# Altium schematic sheet AC2.SchDoc: AMF CONTROLLER GC12
size A4; Author: SURAJ; CompanyName: SIMCONS; DrawnBy: SURAJ; Engineer: SURAJ; Organization: SIMCONS; Drawing TiTLE: SIMCONS AMF
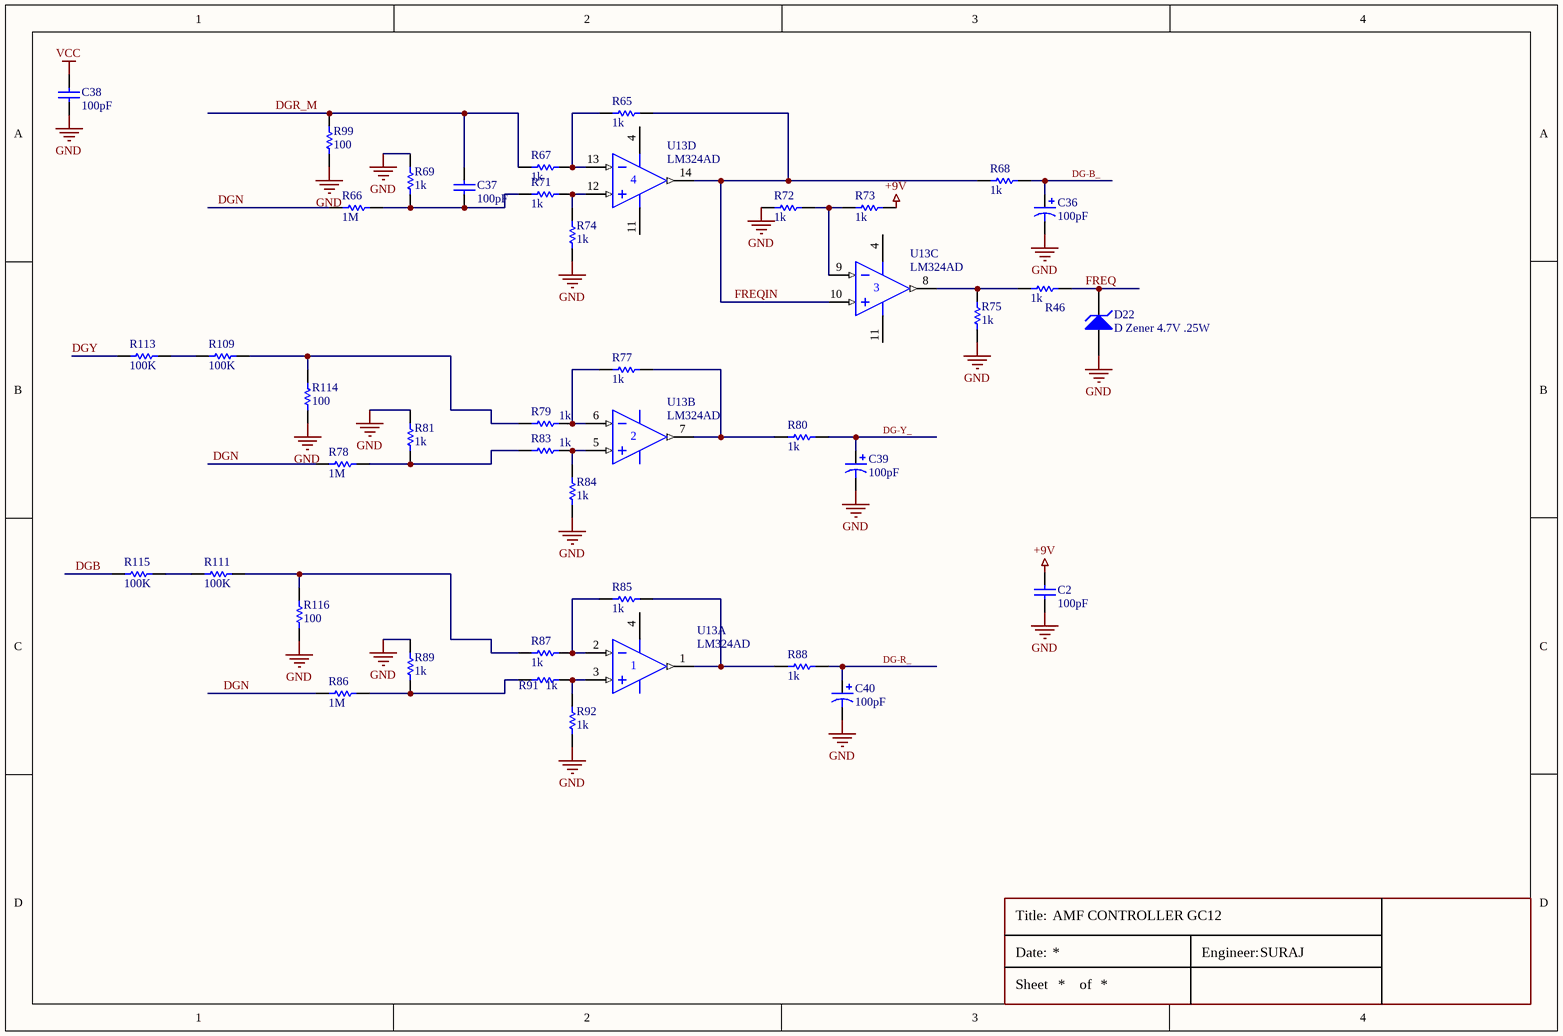
[diagram p0: AC2.SchDoc]

## Parts
C2  value 100pF  [C1206VW]  (hidden comment: .1uF 1206)
C36  value 100pF  [Cap_.1]  (hidden comment: 10uF/63V)
C37  value 100pF  [C1206VW]  (hidden comment: 22nF 1206)
C38  value 100pF  [C1206VW]  (hidden comment: .1uF 1206)
C39  value 100pF  [Cap_.1]  (hidden comment: 10uF/63V)
C40  value 100pF  [Cap_.1]  (hidden comment: 10uF/63V)
D22  D Zener 4.7V .25W  [DZENOR .25W]
R46  value 1k  [R1206VW]  (hidden comment: 470E 1206)
R65  value 1k  [R1206VW]  (hidden comment: 1M 1206)
R66  value 1M  [RES_RAD_1W]  (hidden comment: 1M MFR)
R67  value 1k  [R1206VW]  (hidden comment: 220K 1206)
R68  value 1k  [R1206VW]  (hidden comment: 33K 1206)
R69  value 1k  [R1206VW]  (hidden comment: 4.7K 1206)
R71  value 1k  [R1206VW]  (hidden comment: 220K 1206)
R72  value 1k  [R1206VW]  (hidden comment: 1K 1206)
R73  value 1k  [R1206VW]  (hidden comment: 10K 1206)
R74  value 1k  [R1206VW]  (hidden comment: 1M 1206)
R75  value 1k  [R1206VW]  (hidden comment: 10K 1206)
R77  value 1k  [R1206VW]  (hidden comment: 1M 1206)
R78  value 1M  [RES_RAD_1W]  (hidden comment: 1M MFR)
R79  value 1k  [R1206VW]  (hidden comment: 220K 1206)
R80  value 1k  [R1206VW]  (hidden comment: 33K 1206)
R81  value 1k  [R1206VW]  (hidden comment: 4.7K 1206)
R83  value 1k  [R1206VW]  (hidden comment: 220K 1206)
R84  value 1k  [R1206VW]  (hidden comment: 1M 1206)
R85  value 1k  [R1206VW]  (hidden comment: 1M 1206)
R86  value 1M  [RES_RAD_1W]  (hidden comment: 1M MFR)
R87  value 1k  [R1206VW]  (hidden comment: 220K 1206)
R88  value 1k  [R1206VW]  (hidden comment: 33K 1206)
R89  value 1k  [R1206VW]  (hidden comment: 4.7K 1206)
R91  value 1k  [R1206VW]  (hidden comment: 220K 1206)
R92  value 1k  [R1206VW]  (hidden comment: 1M 1206)
R99  value 100  [R1206VW]  (hidden comment: 4.7K 1206)
R109  value 100K  [AXIAL-0.5]  (hidden comment: MFR 1M .5W)
R111  value 100K  [AXIAL-0.5]  (hidden comment: MFR 1M .5W)
R113  value 100K  [AXIAL-0.5]  (hidden comment: MFR 1M .5W)
R114  value 100  [R1206VW]  (hidden comment: 4.7K 1206)
R115  value 100K  [AXIAL-0.5]  (hidden comment: MFR 1M .5W)
R116  value 100  [R1206VW]  (hidden comment: 4.7K 1206)
U13  LM324AD  [D014_M]  (parts A,B,C,D of 4)

## Nets
+9V: C2.2 R73.1 U13.4(V+)
GND: C2.1 C36.2 C38.1 C39.2 C40.2 D22.1(A) R69.2 R72.2 R74.1 R75.2 R81.2 R84.1 R89.2 R92.1 R99.1 R114.1 R116.1 U13.11(V-)
VCC: C38.2
DG-B_: C36.1 R68.1
DG-R_: C40.1 R88.1
DG-Y_: C39.1 R80.1
DGB: R115.1
DGN: R66.1 R78.1 R86.1
DGR_M: C37.2 R67.2 R99.2
DGY: R113.1
FREQ: D22.2(K) R46.2
FREQIN: R65.1 R68.2 U13.10(IN+) U13.14(OUT)
NetC37_1: C37.1 R66.2 R69.1 R71.2
NetR46_1: R46.1 R75.1 U13.8(OUT)
NetR65_2: R65.2 R67.1 U13.13(IN-)
NetR71_1: R71.1 R74.2 U13.12(IN+)
NetR72_1: R72.1 R73.2 U13.9(IN-)
NetR77_1: R77.1 R80.2 U13.7(OUT)
NetR77_2: R77.2 R79.1 U13.6(IN-)
NetR78_2: R78.2 R81.1 R83.2
NetR79_2: R79.2 R109.2 R114.2
NetR83_1: R83.1 R84.2 U13.5(IN+)
NetR85_1: R85.1 R88.2 U13.1(OUT)
NetR85_2: R85.2 R87.1 U13.2(IN-)
NetR86_2: R86.2 R89.1 R91.2
NetR87_2: R87.2 R111.2 R116.2
NetR91_1: R91.1 R92.2 U13.3(IN+)
NetR109_1: R109.1 R113.2
NetR111_1: R111.1 R115.2

## Notes on the sheet
- Title:
- Date:
- Sheet
- of
- Engineer:

## Library data of the parts
C2 C37 C38 = Cap: Capacitor; Published: 8-Jun-2000; LatestRevisionDate: 17-Jul-2002; LatestRevisionNote: Re-released for DXP Platform.; PackageReference: RAD-0.3; Publisher: Altium Limited; PackageDescription: Radial Cap, Thru-Hole; 2 Leads; 0.3 in Pin Spacing
C36 C39 C40 = Cap Pol1: Polarized Capacitor (Radial); Published: 8-Jun-2000; LatestRevisionDate: 17-Jul-2002; LatestRevisionNote: Re-released for DXP Platform.; PackageReference: RB7.6-15; Publisher: Altium Limited; PackageDescription: Polarized Capacitor (Radial); 2 Leads
D22 = D Zener: Zener Diode; Published: 8-Jun-2000; LatestRevisionDate: 17-Jul-2002; LatestRevisionNote: Re-released for DXP Platform.; PackageReference: DIODE-0.7; Publisher: Altium Limited; PackageDescription: Diode, Thru-Hole; 2 Leads; 0.7 in Pin Spacing
R46 R65-R69 R71-R75 R77-R81 R83-R89 R91 R92 R99 R109 R111 R113-R116 = Res Semi: Semiconductor Resistor; Published: 8-Jun-2000; LatestRevisionDate: 17-Jul-2002; LatestRevisionNote: Re-released for DXP Platform.; PackageReference: AXIAL-0.5; Publisher: Altium Limited; PackageDescription: Axial Device, Thru-Hole; 2 Leads; 0.5 in Pin Spacing
U13 = LM324AD: Quadruple Operational Amplifier; Published: 15-Apr-2002; LatestRevisionDate: 13-Apr-2006; LatestRevisionNote: IPC-7351 Footprint Added.; DatasheetVersion: Jan-1989; PackageVersion: Jan-1998; PackageReference: D014; Publisher: Altium Limited; PackageDescription: 14-Pin Small Outline Integrated Circuit 1.27 mm Pitch; Code_IPC: SOIC127P600-14; ComponentLink1Description: Manufacturer Link; ComponentLink1URL: http://www.ti.com/; ComponentLink2Description: Datasheet; ComponentLink2URL: http://www-s.ti.com/sc/ds/lm324.pdf